# EAGLE design thar_board_land_mk1 (EAGLE 9.6.2)
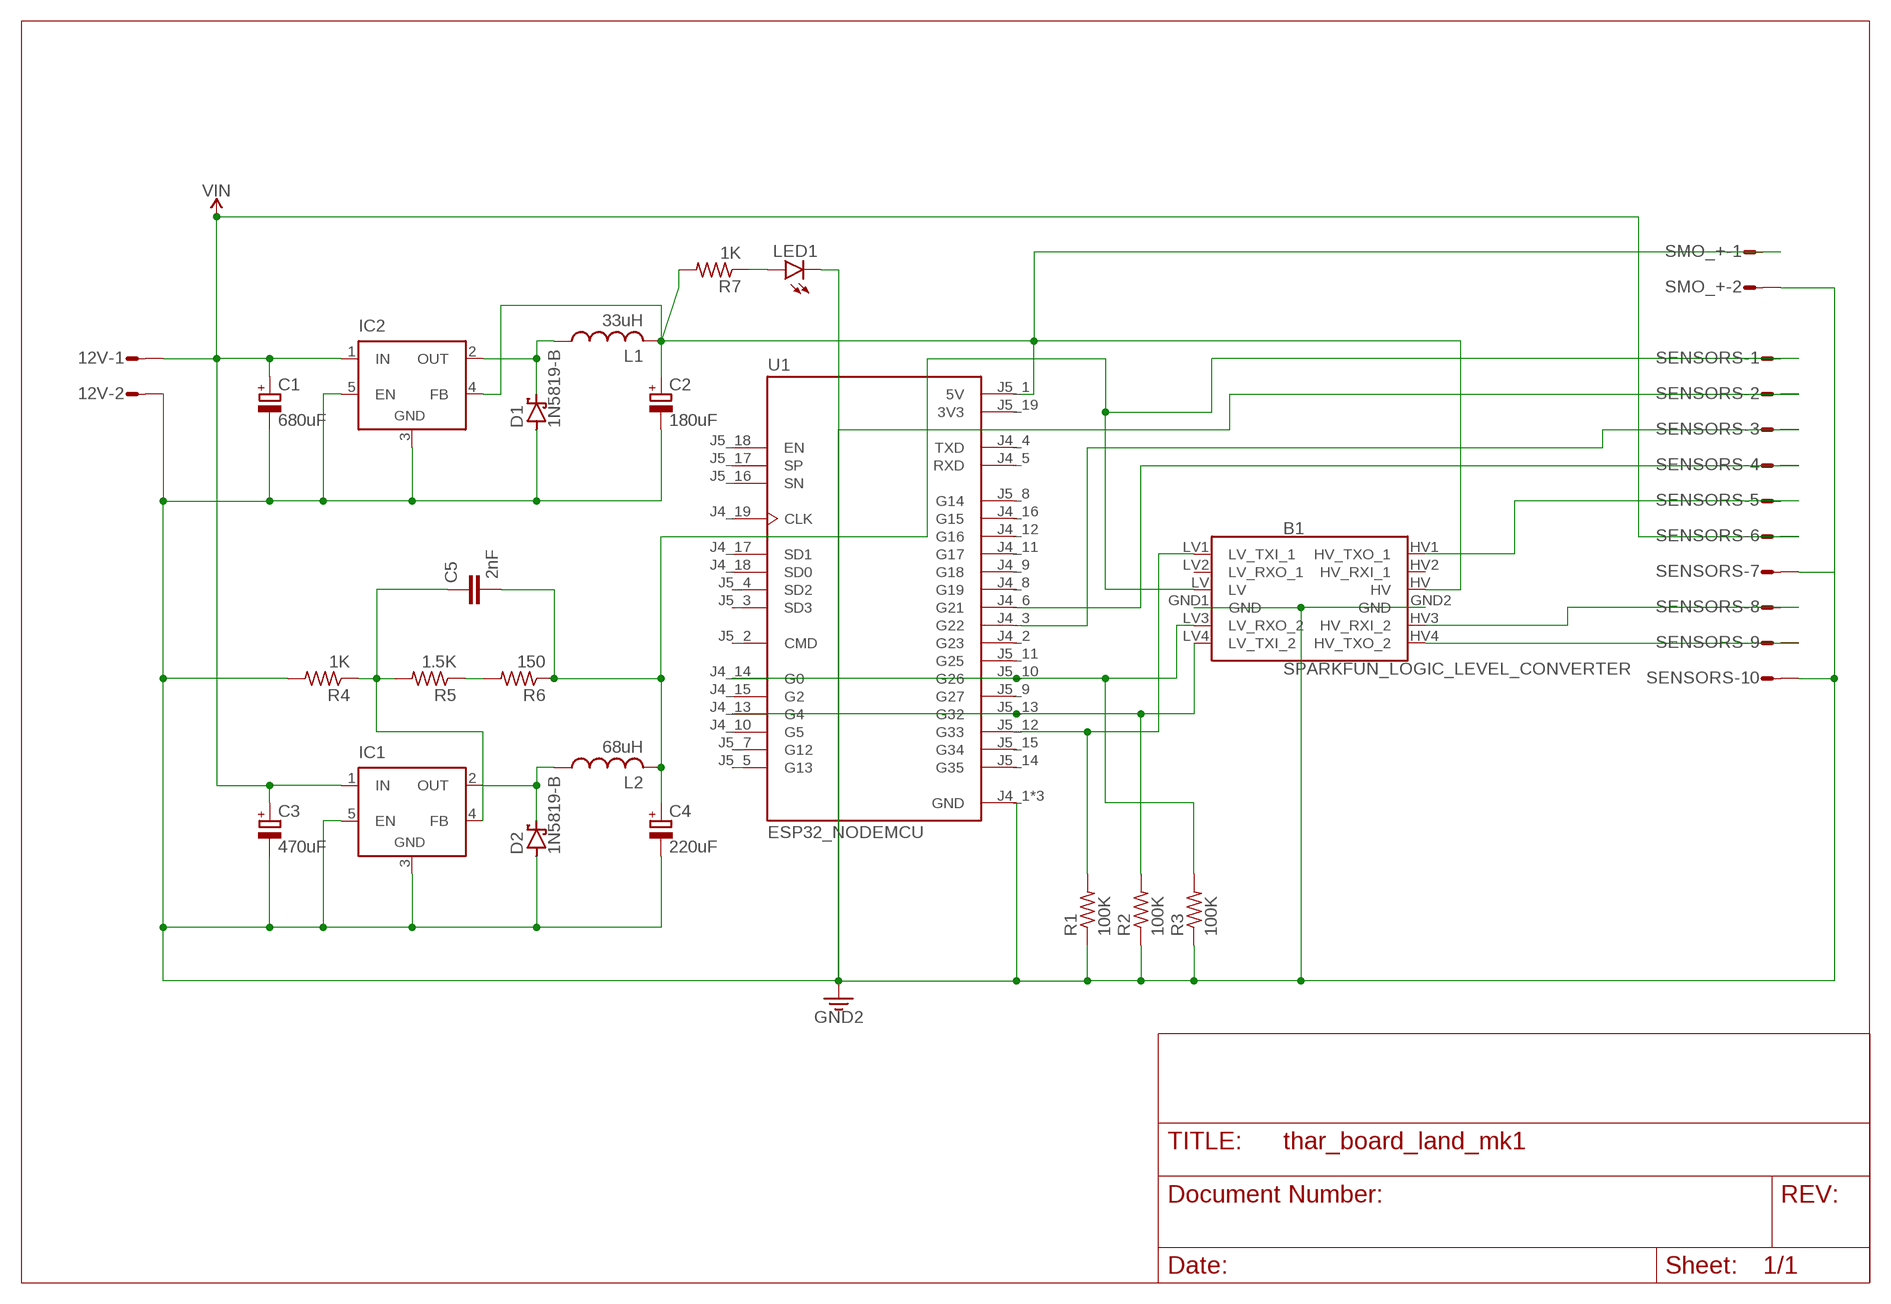
[diagram p0: schematic, sheet 1]

## Parts
12V  L02P  [L02P]
B1  SPARKFUN_LOGIC_LEVEL_CONVERTER  [SPARKFUN_LOGIC_LEVEL_CONVERTER]
C1  680uF  CPOL-EUE2.5-7  [E2,5-7]
C2  180uF  CPOL-EUE2.5-7  [E2,5-7]
C3  470uF  CPOL-EUE2.5-7  [E2,5-7]
C4  220uF  CPOL-EUE2.5-7  [E2,5-7]
C5  2nF  C-EU025-025X050  [C025-025X050]
D1  1N5819-B  [DO41-7.6]
D2  1N5819-B  [DO41-7.6]
IC1  LM2596TH  [TO220-52]
IC2  LM2596TH  [TO220-52]
L1  33uH  L-USTFI0410  [TFI0410]
L2  68uH  L-USTFI0410  [TFI0410]
LED1  LED3MM  [LED3MM]
R1  100K  R-US_0207/10  [0207/10]
R2  100K  R-US_0207/10  [0207/10]
R3  100K  R-US_0207/10  [0207/10]
R4  1K  R-US_0207/10  [0207/10]
R5  1.5K  R-US_0207/10  [0207/10]
R6  150  R-US_0207/10  [0207/10]
R7  1K  R-US_0207/10  [0207/10]
SENSORS  L10P  [L10P]
SMO_+  L02P  [L02P]
U1  ESP32_NODEMCU  [MODULE_ESP32_NODEMCU]

## Nets
3.3V: B1.LV C4.+ C5.2 L2.2 R6.1 SENSORS.1
5V: B1.HV C2.+ IC2.4(FB) L1.2 R7.2 SMO_+.1 U1.J5_1(5V)
GND: 12V.2 B1.GND1(GND) B1.GND2(GND) C1.- C2.- C3.- C4.- D1.A D2.A IC1.3(GND) IC1.5(EN) IC2.3(GND) IC2.5(EN) LED1.K(C) R1.1 R2.1 R3.1 R4.2 SENSORS.2 SENSORS.7 SENSORS.10 SMO_+.2 U1.J4_1(GND) U1.J4_7(GND) U1.J5_6(GND) ; supply symbol labelled GND2
N$1: LED1.A R7.1
N$2: SENSORS.3 U1.J4_3(G22)
N$3: SENSORS.4 U1.J4_6(G21)
N$4: B1.HV3(HV_RXI_2) SENSORS.8
N$5: D1.C IC2.2(OUT) L1.1
N$7: B1.HV4(HV_TXO_2) SENSORS.9
N$8: D2.C IC1.2(OUT) L2.1
N$9: B1.HV1(HV_TXO_1) SENSORS.5
N$10: B1.LV1(LV_TXI_1) R1.2 U1.J5_12(G33)
N$11: B1.LV3(LV_RXO_2) R3.2 U1.J4_14(G0) U1.J5_10(G26)
N$12: B1.LV4(LV_TXI_2) R2.2 U1.J4_13(G4) U1.J5_13(G32)
N$13: C5.1 IC1.4(FB) R4.1 R5.2
N$15: R5.1 R6.2
VIN: 12V.1 C1.+ C3.+ IC1.1(IN) IC2.1(IN) SENSORS.6
Unconnected: B1.HV2(HV_RXI_1) B1.LV2(LV_RXO_1) U1.J4_2(G23) U1.J4_4(TXD) U1.J4_5(RXD) U1.J4_8(G19) U1.J4_9(G18) U1.J4_10(G5) U1.J4_11(G17) U1.J4_12(G16) U1.J4_15(G2) U1.J4_16(G15) U1.J4_17(SD1) U1.J4_18(SD0) U1.J4_19(CLK) U1.J5_2(CMD) U1.J5_3(SD3) U1.J5_4(SD2) U1.J5_5(G13) U1.J5_7(G12) U1.J5_8(G14) U1.J5_9(G27) U1.J5_11(G25) U1.J5_14(G35) U1.J5_15(G34) U1.J5_16(SN) U1.J5_17(SP) U1.J5_18(EN)

## Power pins joined to a net without a drawn wire
3V3: U1.J5_19(3V3)

## Library data of the parts
12V SMO_+ = con-amp-mt:L02P: AMP MT CONNECTOR; OC_FARNELL: unknown; OC_NEWARK: unknown
B1 = SparkFun-Boards:SPARKFUN_LOGIC_LEVEL_CONVERTER: SparkFun Logic Level Converter -Bi-Directional This is the mechnical outline for the 3.3V - 5V bi directional logic level converter. *Note, the "LOCK" Package has the header pins staggered by an offset of 5 mils (off center line), so that when you slide a row of standard 0.1" headers into the PTH pads, it will hold position vertically. See the follwing turorial for more information on this type of special footprints: Sneaky Footprints <https://www.sparkfun.com/tutorials/114> SparkFun Products: SparkFun Logic Level Converter - Bi-Directional <https://www.sparkfun.com/products/12009>
C1-C4 = rcl:CPOL-EU: POLARIZED CAPACITOR, European symbol; SPICEPREFIX: C
C5 = rcl:C-EU: CAPACITOR, European symbol; SPICEPREFIX: C
D1 D2 = diode:1N581*: 1.0A SCHOTTKY BARRIER RECTIFIER Source: http://www.diodes.com/datasheets/ds23001.pdf
IC1 IC2 = linear:LM2596T: STEP-DOWN VOLTAGE REGULATOR
L1 L2 = rcl:L-US: INDUCTOR, American symbol; SPICEPREFIX: L
LED1 = led:LED: LED OSRAM: - CHIPLED LG R971, LG N971, LY N971, LG Q971, LY Q971, LO R971, LY R971 LH N974, LH R974 LS Q976, LO Q976, LY Q976 LO Q996 - Hyper CHIPLED LW Q18S LB Q993, LB Q99A, LB R99A - SideLED LS A670, LO A670, LY A670, LG A670, LP A670 LB A673, LV A673, LT A673, LW A673 LH A674 LY A675 LS A676, LA A676, LO A676, LY A676, LW A676 LS A679, LY A679, LG A679 - Hyper Micro SIDELED® LS Y876, LA Y876, LO Y876, LY Y876 LT Y87S - SmartLED LW L88C, LW L88S LB L89C, LB L89S, LG L890 LS L89K, LO L89K, LY L89K LS L896, LA L896, LO L896, LY L896 - TOPLED LS T670, LO T670, LY T670, LG T670, LP T670 LSG T670, LSP T670, LSY T670, LOP T670, LYG T670 LG T671, LOG T671, LSG T671 LB T673, LV T673, LT T673, LW T673 LH T674 LS T676, LA T676, LO T676, LY T676, LB T676, LH T676, LSB T676, LW T676 LB T67C, LV T67C, LT T67C, LS T67K, LO T67K, LY T67K, LW E67C LS E67B, LA E67B, LO E67B, LY E67B, LB E67C, LV E67C, LT E67C LW T67C LS T679, LY T679, LG T679 LS T770, LO T770, LY T770, LG T770, LP T770 LB T773, LV T773, LT T773, LW T773 LH T774 LS E675, LA E675, LY E675, LS T675 LS T776, LA T776, LO T776, LY T776, LB T776 LHGB T686 LT T68C, LB T68C - Hyper Mini TOPLED® LB M676 - Mini TOPLED Santana® LG M470 LS M47K, LO M47K, LY M47K Source: http://www.osram.convergy.de LUXEON: - LUMILED® LXK2-PW12-R00, LXK2-PW12-S00, LXK2-PW14-U00, LXK2-PW14-V00 LXK2-PM12-R00, LXK2-PM12-S00, LXK2-PM14-U00 LXK2-PE12-Q00, LXK2-PE12-R00, LXK2-PE12-S00, LXK2-PE14-T00, LXK2-PE14-U00 LXK2-PB12-K00, LXK2-PB12-L00, LXK2-PB12-M00, LXK2-PB14-N00, LXK2-PB14-P00, LXK2-PB14-Q00 LXK2-PR12-L00, LXK2-PR12-M00, LXK2-PR14-Q00, LXK2-PR14-R00 LXK2-PD12-Q00, LXK2-PD12-R00, LXK2-PD12-S00 LXK2-PH12-R00, LXK2-PH12-S00 LXK2-PL12-P00, LXK2-PL12-Q00, LXK2-PL12-R00 Source: www.luxeon.com KINGBRIGHT: KA-3528ASYC Source: www.kingbright.com
R1-R7 = rcl:R-US_: RESISTOR, American symbol; SPICEPREFIX: R
SENSORS = con-amp-mt:L10P: AMP MT CONNECTOR; OC_FARNELL: unknown; OC_NEWARK: unknown
U1 = ESP32_NODEMCU:ESP32_NODEMCU: Check availability <https://pricing.snapeda.com/parts/ESP32%20NodeMCU/Espressif%20Systems/view-part?ref=eda>; AVAILABILITY: Not in stock; DESCRIPTION: NodeMCU is an open source loT platform. ESP32 is a series of low cost, low power system-on-chip (SoC) microcontrollers with integrated Wi-Fi & dual-mode Bluetooth.; MF: Espressif Systems; MP: ESP32 NodeMCU; PACKAGE: Package; PRICE: None

## Board
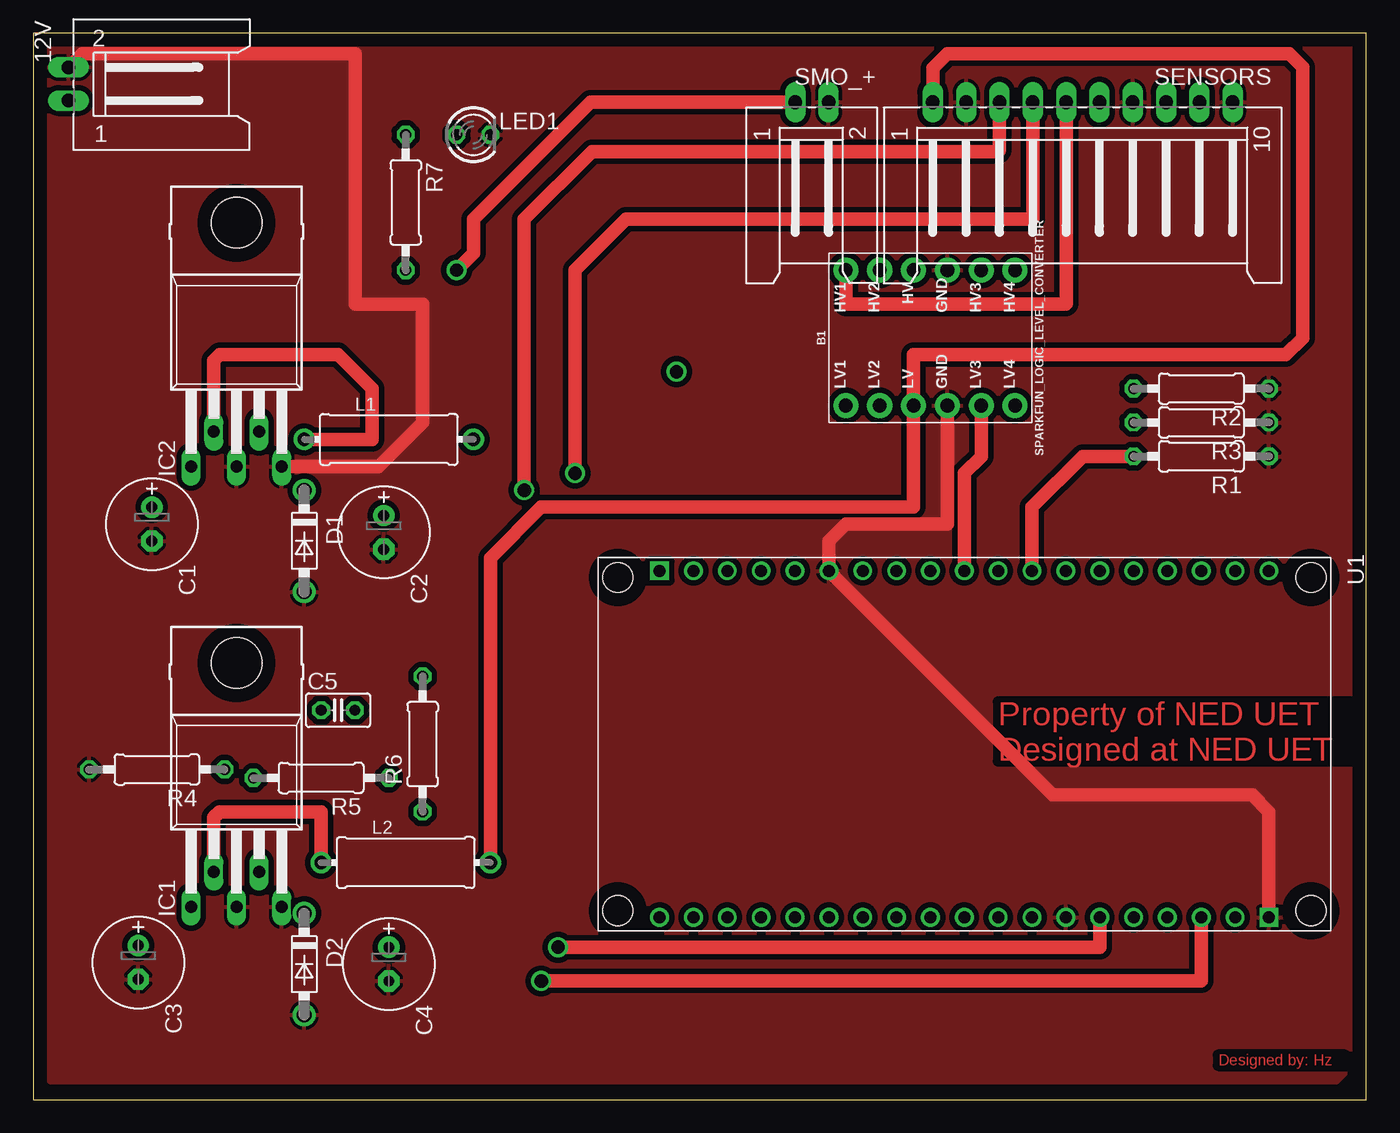
[diagram p1: board, top side]
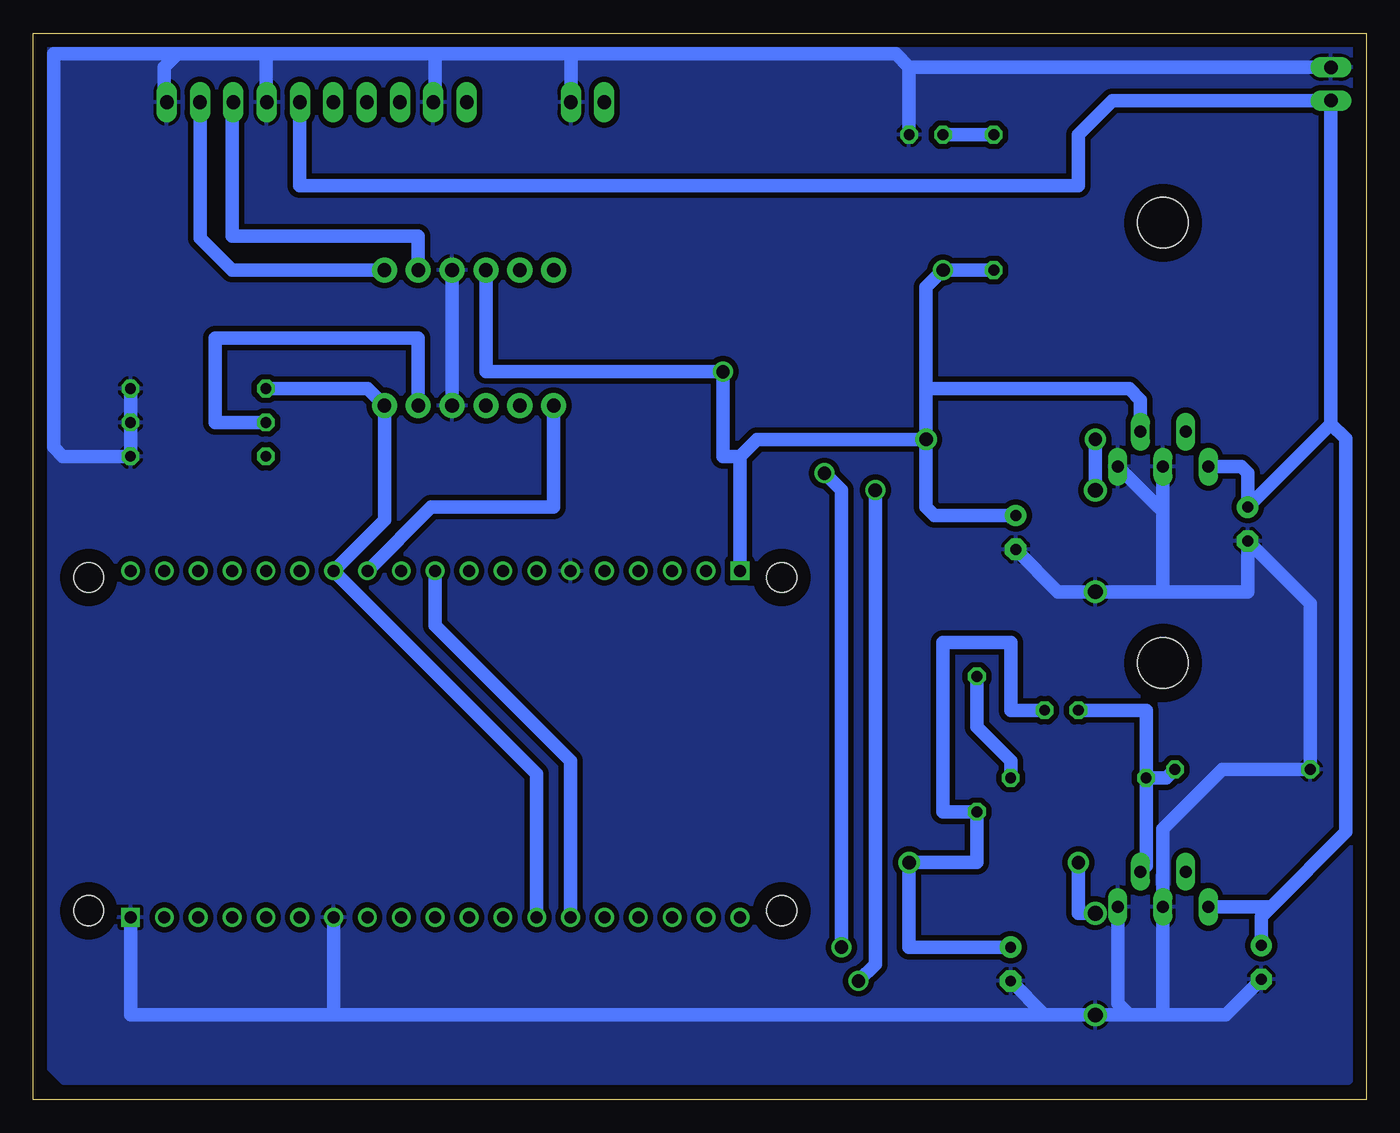
[diagram p2: board, bottom side, seen from below]

Size 100 x 80 mm. Coordinates in mm from the lower left corner, seen from the top.
Outline: 0,0 100,0 100,80 0,80 0,0
Copper layers (1*16): Top 0.035mm / dielectric 1.5mm / Bottom 0.035mm
Design rules "default": minimum track width 6mil, minimum drill 0.35mm, track to track 6mil, track to pad 6mil, pad to pad 6mil, via to via 6mil, smd to smd 6mil, copper to edge 40mil, drill to drill 6mil, minimum pad ring 10mil, minimum via ring 8mil, stop-mask expansion 4mil, vias tented up to drill 0mil, thermal gap 10mil

### Footprints (pad centres in the part's own frame; a part is rotated, then mirrored left to right if it is on the bottom)
L02P = drill 1.016 long: 1 1.25,-6.25; 2 -1.25,-6.25
SPARKFUN_LOGIC_LEVEL_CONVERTER = drill 1.016 pad 1.88: GND1 -5.08,-1.27; GND2 5.08,-1.27; HV 5.08,1.27; HV1 5.08,6.35; HV2 5.08,3.81; HV3 5.08,-3.81; HV4 5.08,-6.35; LV -5.08,1.27; LV1 -5.08,6.35; LV2 -5.08,3.81; LV3 -5.08,-3.81; LV4 -5.08,-6.35
E2,5-7 = drill 0.813 pad 1.6: + -1.27,0 | drill 0.813 pad 1.6 octagon: - 1.27,0
C025-025X050 = drill 0.813 octagon: 1 -1.27,0; 2 1.27,0
DO41-7.6 = drill 1.1 pad 1.7: A 3.81,0; C -3.81,0
TO220-52 = drill 0.9 long: 1 -3.4,-21.1; 2 -1.7,-18.47; 3 0,-21.1; 4 1.7,-18.47; 5 3.4,-21.1 | hole 3.8: 0,-2.8
TFI0410 = drill 1 pad 1.6: 1 -6.35,0; 2 6.35,0
LED3MM = drill 0.813 octagon: A -1.27,0; K 1.27,0
0207/10 = drill 0.813 octagon: 1 -5.08,0; 2 5.08,0
L10P = drill 1.016 long: 1 11.25,-6.25; 2 8.75,-6.25; 3 6.25,-6.25; 4 3.75,-6.25; 5 1.25,-6.25; 6 -1.25,-6.25; 7 -3.75,-6.25; 8 -6.25,-6.25; 9 -8.75,-6.25; 10 -11.25,-6.25
MODULE_ESP32_NODEMCU = drill 0.9 pad 1.35 square: J4_1 13,22.86; J5_1 -13,-22.86 | drill 0.9 pad 1.35: J4_2 13,20.32; J4_3 13,17.78; J4_4 13,15.24; J4_5 13,12.7; J4_6 13,10.16; J4_7 13,7.62; J4_8 13,5.08; J4_9 13,2.54; J4_10 13,0; J4_11 13,-2.54; J4_12 13,-5.08; J4_13 13,-7.62; J4_14 13,-10.16; J4_15 13,-12.7; J4_16 13,-15.24; J4_17 13,-17.78; J4_18 13,-20.32; J4_19 13,-22.86; J5_2 -13,-20.32; J5_3 -13,-17.78; J5_4 -13,-15.24; J5_5 -13,-12.7; J5_6 -13,-10.16; J5_7 -13,-7.62; J5_8 -13,-5.08; J5_9 -13,-2.54; J5_10 -13,0; J5_11 -13,2.54; J5_12 -13,5.08; J5_13 -13,7.62; J5_14 -13,10.16; J5_15 -13,12.7; J5_16 -13,15.24; J5_17 -13,17.78; J5_18 -13,20.32; J5_19 -13,22.86 | hole 2.25: -12.5,-26; 12.5,-26; -12.5,26; 12.5,26

### Placement (x,y rotation side)
12V  8.89,76.2 270 top
B1  67.31,57.15 90 top
C1  8.89,43.18 270 top
C2  26.29,42.55 270 top
C3  7.87,10.29 270 top
C4  26.67,10.16 270 top
C5  22.86,29.21 0 top
D1  20.32,41.91 270 top
D2  20.32,10.16 270 top
IC1  15.24,35.56 0 top
IC2  15.24,68.58 0 top
L1  26.67,49.53 0 top
L2  27.94,17.78 0 top
LED1  33.02,72.39 0 top
R1  87.63,48.26 180 top
R2  87.63,53.34 180 top
R3  87.63,50.8 180 top
R4  9.27,24.77 180 top
R5  21.59,24.13 180 top
R6  29.21,26.67 90 top
R7  27.94,67.31 270 top
SENSORS  78.74,68.58 180 top
SMO_+  58.42,68.58 180 top
U1  69.85,26.67 270 top

### Tracks (layer width: path | path; a pad name or v marks a point on that pad's centre or on a via)
3.3V
  Top 1.016: L2.2 34.29,40.64 38.1,44.45 66.04,44.45 B1.LV 66.04,55.88 93.98,55.88 95.25,57.15 95.25,77.47 94.24,78.48 68.58,78.48 67.49,77.39 SENSORS.1
  Bottom 1.016: C5.2 26.67,29.21 26.67,34.29 31.75,34.29 31.75,21.59 R6.1 29.21,17.78 L2.2 34.29,11.43 C4.+
5V  (via drill 1)
  Top 1.016: v31.75,62.23 33.02,63.5 33.02,66.04 41.81,74.83 SMO_+.1
  Bottom 1.016: L1.2 33.02,44.45 32.38,43.81 C2.+ | IC2.4 16.94,52.5 17.78,53.34 33.02,53.34 L1.2 | L1.2 45.72,49.53 46.99,48.26 | 46.99,48.26 U1.J5_1 | R7.2 v31.75,62.23 33.02,60.96 L1.2 | 46.99,48.26 48.26,48.26 v48.26,54.61 66.04,54.61 B1.HV
GND
  Top 1.016: IC2.5 25.89,47.48 29.21,50.8 29.21,59.69 24.13,59.69 24.13,78.48 3.67,78.48 12V.2 | B1.GND1 68.58,43.18 60.96,43.18 59.69,41.91 U1.J5_6 76.5,22.86 91.44,22.86 92.71,21.59 U1.J4_1
  Bottom 1.016: C3.- 10.54,6.35 15.24,6.35 | 15.24,6.35 17.78,6.35 | 17.78,6.35 D2.A 24.13,6.35 | 24.13,6.35 C4.- | 15.24,38.1 8.89,38.1 C1.- 4.19,37.21 R4.2 10.79,24.77 15.24,20.32 IC1.3 15.24,6.35 | 15.24,38.1 D1.A 23.11,38.1 C2.- | IC2.3 15.24,44.45 | 15.24,44.45 15.24,38.1 | IC2.5 15.61,44.45 15.24,44.45 | LED1.K 34.29,77.47 | 34.29,77.47 2.66,77.47 12V.2 | SMO_+.2 59.67,78.46 59.69,78.48 | 59.69,78.48 35.3,78.48 34.29,77.47 | 59.69,78.48 69.85,78.48 | 69.85,78.48 82.55,78.48 | 82.55,78.48 82.55,74.89 SENSORS.7 | 82.55,78.48 89.16,78.48 | 89.16,78.48 90.17,77.47 90.17,75.01 SENSORS.10 | SENSORS.2 69.85,74.97 69.85,78.48 | IC1.5 18.64,7.21 17.78,6.35 | U1.J4_1 92.71,6.35 77.47,6.35 | 77.47,6.35 U1.J4_7 | 77.47,6.35 24.13,6.35 | R2.1 R3.1 R1.1 97.79,48.26 98.48,48.95 98.48,78.48 89.16,78.48 | B1.GND1 B1.GND2
  pour Bottom (isolate 0.406): 0,80.01 99.06,80.01 99.06,2.54 97.79,1.27 1.27,1.27 0,2.54
  pour Top (isolate 0.406): 0,80.01 99.06,80.01 99.06,2.54 97.79,1.27 1.27,1.27 0,2.54
N$1
  Bottom 1.016: R7.1 LED1.A
N$2  (via drill 1)
  Top 1.016: U1.J4_3 87.63,8.89 v38.1,8.89 | v36.83,45.72 36.83,66.04 41.91,71.12 72.39,71.12 72.49,71.22 SENSORS.3
  Bottom 1.016: v38.1,8.89 36.83,10.16 v36.83,45.72
N$3  (via drill 1)
  Top 1.016: U1.J4_6 80.01,11.43 v39.37,11.43 | v40.64,46.99 40.64,62.23 44.45,66.04 74.93,66.04 74.99,66.1 SENSORS.4
  Bottom 1.016: v39.37,11.43 39.37,45.72 v40.64,46.99
N$4
  Bottom 1.016: B1.HV3 71.12,64.77 85.09,64.77 85.09,74.73 SENSORS.8
N$5
  Top 1.016: IC2.2 13.54,55.45 13.97,55.88 22.86,55.88 25.4,53.34 25.4,49.53 L1.1
  Bottom 1.016: L1.1 D1.C
N$7
  Bottom 1.016: SENSORS.9 87.49,64.63 85.09,62.23 B1.HV4
N$8
  Top 1.016: L2.1 21.59,21.59 13.97,21.59 13.54,21.16 IC1.2
  Bottom 1.016: D2.C 21.59,13.97 L2.1
N$9
  Top 1.016: SENSORS.5 77.49,59.71 77.47,59.69 60.96,59.69 B1.HV1
N$10
  Top 1.016: U1.J5_12 74.93,44.45 78.74,48.26 R1.2
  Bottom 1.016: U1.J5_12 70.15,44.45 60.96,44.45 B1.LV1
N$11
  Top 1.016: U1.J5_10 69.85,46.99 71.12,48.26 B1.LV3
  Bottom 1.016: U1.J4_14 59.69,25.4 69.85,35.56 U1.J5_10 | R3.2 86.36,50.8 86.36,57.15 71.12,57.15 B1.LV3
N$12
  Bottom 1.016: U1.J4_13 62.23,24.43 U1.J5_13 73.66,43.48 B1.LV4 74.93,53.34 R2.2
N$13
  Bottom 1.016: IC1.4 16.51,17.52 R5.2 | R4.1 14.99,24.13 R5.2 | C5.1 16.51,29.21 R5.2
N$15
  Bottom 1.016: R6.2 29.21,27.94 26.67,25.4 R5.1
VIN
  Bottom 1.016: 2.64,50.7 12V.1 19.03,74.95 21.59,72.39 21.59,68.58 80.01,68.58 80.01,74.81 SENSORS.6 | 2.64,50.7 C1.+ 8.89,46.99 9.38,47.48 IC2.1 | 7.13,14.46 7.87,13.72 C3.+ 8,11.43 | 7.13,14.46 1.52,20.07 1.52,49.58 2.64,50.7 | IC1.1 7.13,14.46

### Text on the board
Top: Property of NED UET / Designed at NED UET | Designed by: Hz